# EAGLE design RatDBS-Plastic2032Battery (EAGLE 7.3.0)
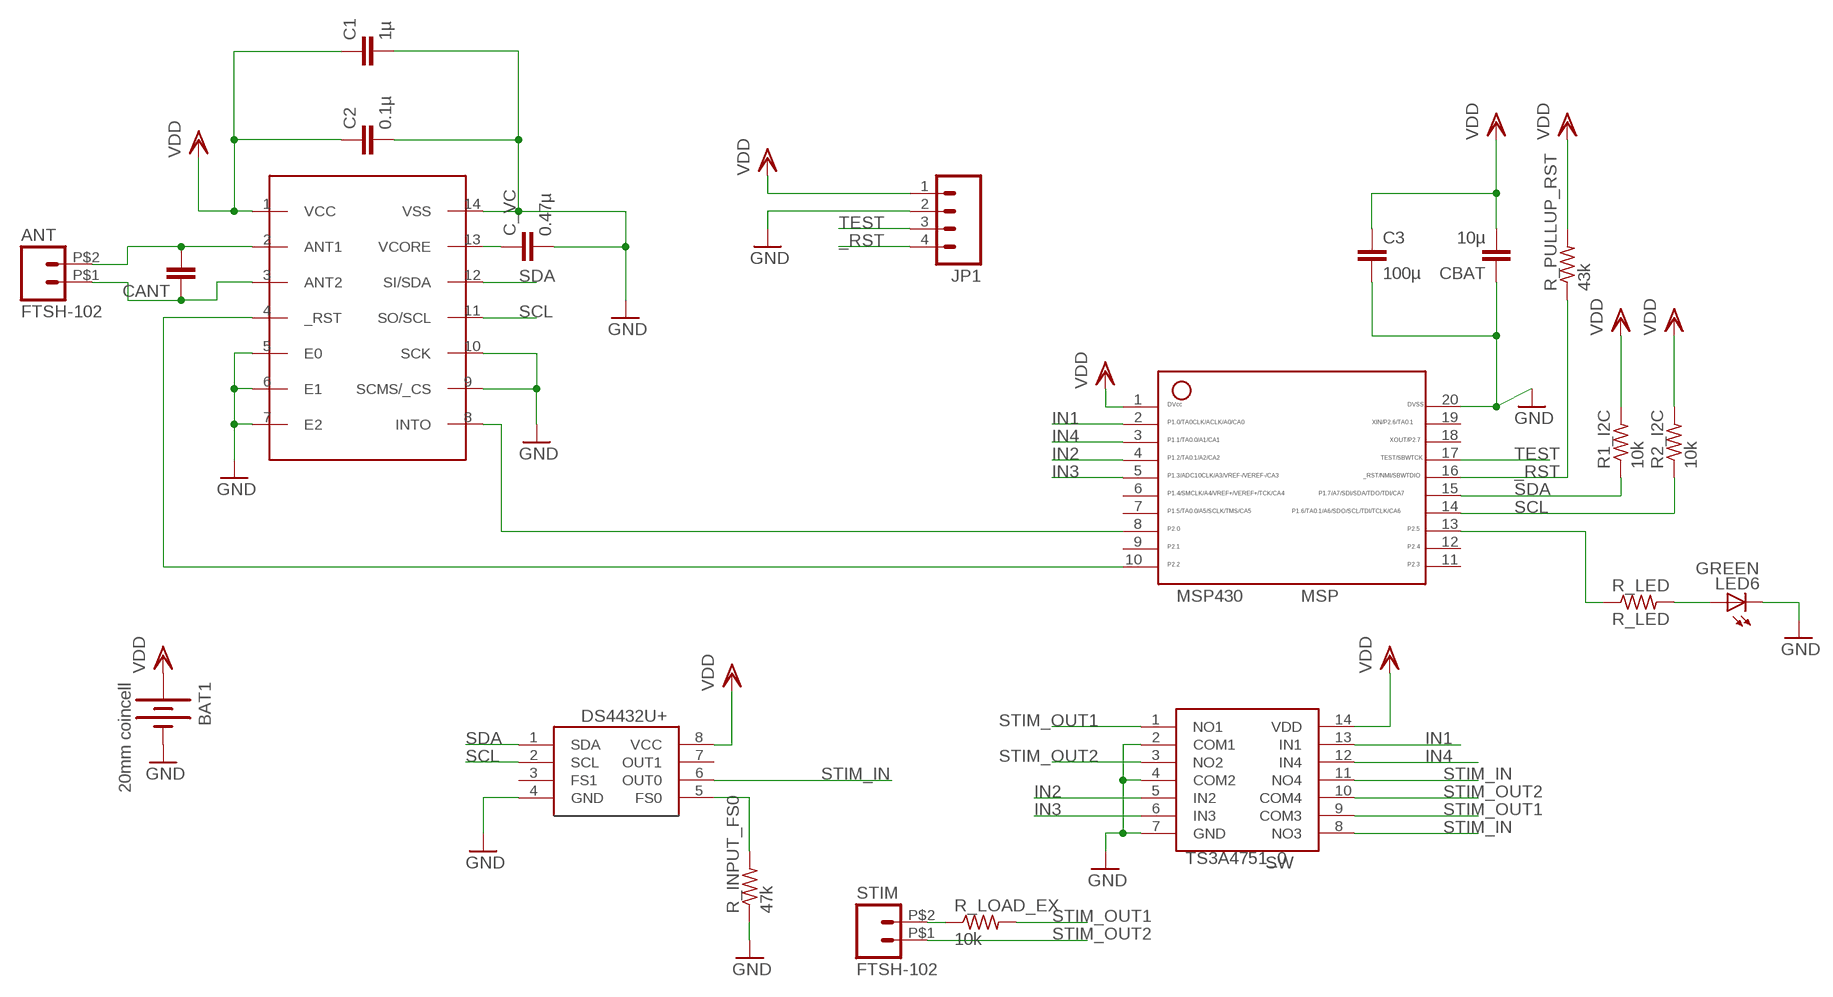
[diagram p0: schematic, sheet 1]

## Parts
ANT  FTSH-102  [FTSH-102-DH]
BAT1  20mm coincell  BATTERY  [BATTCOM_20MM_PLASTIC_STUDS]
C1  1µ  C-EUC0603  [C0603]
C2  0.1µ  C-EUC0603  [C0603]
C3  100µ  C-EUC1206  [C1206]
C_VC  0.47µ  C-EUC0603  [C0603]
CANT  C-EUC0603  [C0603]
CBAT  10µ  C-EUC0603  [C0603]
DS4432U+  DS4432U+  [8_PIN]
JP1  M041.27MM  [1X04-1.27MM]
LED6  GREEN  LED1206  [LED-1206]
MSP430  MSP  MSP430  [20_PIN]
R1_I2C  10k  R-US_R0603  [R0603]
R2_I2C  10k  R-US_R0603  [R0603]
R_INPUT_FS0  47k  R-US_R0603  [R0603]
R_LED  R_LED  R-US_R0603  [R0603]
R_LOAD_EX  10k  R-US_R0603  [R0603]
R_PULLUP_RST  43k  R-US_R0603  [R0603]
STIM  FTSH-102  [FTSH-102-DH]
TS3A4751_0  SW  TS3A4751  [14_PIN]
U$1  RF  RF430CL330H  [PW_R-PDSO-G14]

## Nets
_RST: JP1.4 MSP430.16 R_PULLUP_RST.1
GND: BAT1.2(-) C1.2 C2.2 C3.2 C_VC.2 CBAT.1 DS4432U+.4(GND) JP1.2 LED6.C MSP430.20 R_INPUT_FS0.1 TS3A4751_0.2(COM1) TS3A4751_0.4(COM2) TS3A4751_0.7(GND) U$1.5(E0) U$1.6(E1) U$1.7(E2) U$1.9(SCMS/_CS) U$1.10(SCK) U$1.14(VSS)
IN1: MSP430.2 TS3A4751_0.13(IN1)
IN2: MSP430.4 TS3A4751_0.5(IN2)
IN3: MSP430.5 TS3A4751_0.6(IN3)
IN4: MSP430.3 TS3A4751_0.12(IN4)
N$1: C_VC.1 U$1.13(VCORE)
N$2: ANT.P$2 CANT.2 U$1.2(ANT1)
N$3: MSP430.8 U$1.8(INTO)
N$4: R_LOAD_EX.1 STIM.P$2
N$5: MSP430.13 R_LED.1
N$6: MSP430.7
N$7: MSP430.10 U$1.4(_RST)
N$8: DS4432U+.5(FS0) R_INPUT_FS0.2
N$9: LED6.A R_LED.2
N$12: ANT.P$1 CANT.1 U$1.3(ANT2)
SCL: DS4432U+.2(SCL) MSP430.14 R2_I2C.1 U$1.11(SO/SCL)
SDA: DS4432U+.1(SDA) MSP430.15 R1_I2C.1 U$1.12(SI/SDA)
STIM_IN: DS4432U+.6(OUT0) TS3A4751_0.8(NO3) TS3A4751_0.11(NO4)
STIM_OUT1: R_LOAD_EX.2 TS3A4751_0.1(NO1) TS3A4751_0.9(COM3)
STIM_OUT2: STIM.P$1 TS3A4751_0.3(NO2) TS3A4751_0.10(COM4)
TEST: JP1.3 MSP430.17
VDD: BAT1.1(+) C1.1 C2.1 C3.1 CBAT.2 DS4432U+.8(VCC) JP1.1 MSP430.1 R1_I2C.2 R2_I2C.2 R_PULLUP_RST.2 TS3A4751_0.14(VDD) U$1.1(VCC)
Unconnected: DS4432U+.3(FS1) DS4432U+.7(OUT1) MSP430.6 MSP430.9 MSP430.11 MSP430.12 MSP430.18 MSP430.19

## Library data of the parts
ANT STIM = Samtec50Mil:FTSH-102
BAT1 = Battery:BATTERY: Compact CR2032 Battery Holder SMT ground pad 20MM_4LEGS, Digikey: BAT-HLD-001-THM-OTL
C1-C3 C_VC CANT CBAT = rcl:C-EU: CAPACITOR, European symbol
DS4432U+ = RatDBS:DS4432U+: DS4432U+ current DAC
JP1 = SparkFun:M04: Header 4 Standard 4-pin 0.1" header. Use with straight break away headers (SKU : PRT-00116), right angle break away headers (PRT-00553), swiss pins (PRT-00743), machine pins (PRT-00117), and female headers (PRT-00115). Molex polarized connector foot print use with SKU : PRT-08231 with associated crimp pins and housings.
LED6 = SparkFun-LED:LED: LEDs Standard schematic elements and footprints for 5mm, 3mm, 1206, and 0603 sized LEDs. 5mm - Spark Fun Electronics SKU : COM-00529 (and others)
MSP430 = RatDBS:MSP430: MSP430 20 pins
R1_I2C R2_I2C R_INPUT_FS0 R_LED R_LOAD_EX R_PULLUP_RST = BiphasicBoard:R-US_: RESISTOR, American symbol
TS3A4751_0 = BiphasicBoard:TS3A4751: TS3A4751 Quad Switch
U$1 = RF430CL330H:RF430CL330H

## Board
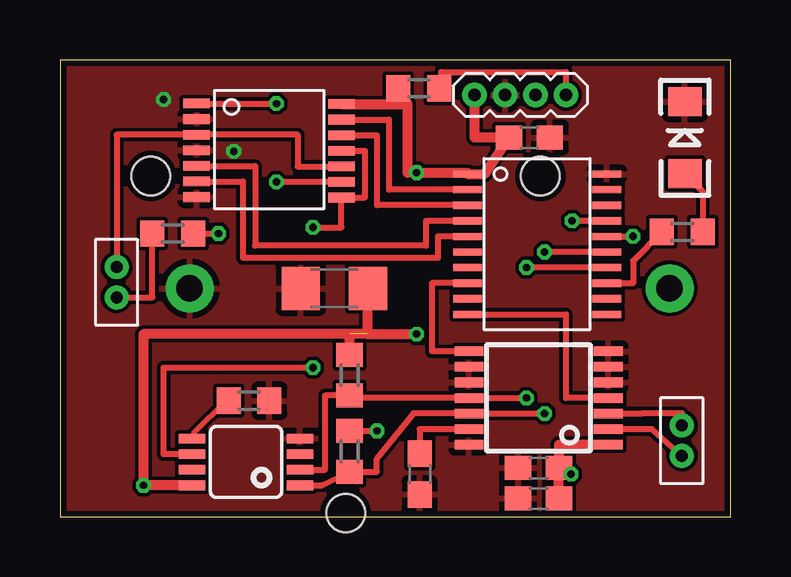
[diagram p1: board, top side]
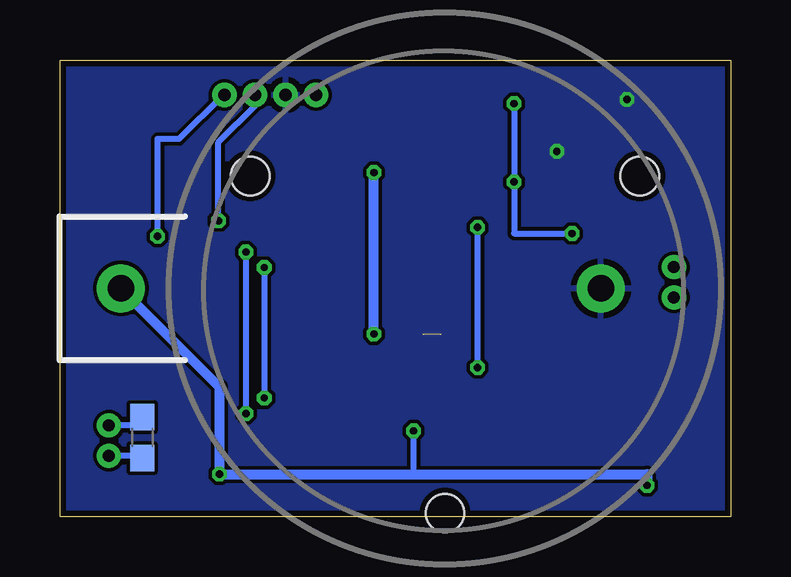
[diagram p2: board, bottom side, seen from below]

Size 27.94 x 19.05 mm. Coordinates in mm from the lower left corner, seen from the top.
Outline: 0,19.05 0,0 27.94,0 27.94,19.05 0,19.05
Copper layers (1*16): Top 0.035mm / dielectric 1.5mm / Bottom 0.035mm
Design rules "Seeed_DRU": minimum track width 6mil, minimum drill 12mil, track to track 6mil, track to pad 6mil, pad to pad 6mil, via to via 6mil, smd to smd 0mil, copper to edge 10mil, drill to drill 10mil, minimum pad ring 10mil, minimum via ring 6mil, stop-mask expansion 2mil, vias tented up to drill 100mil, thermal gap 10mil

### Footprints (pad centres in the part's own frame; a part is rotated, then mirrored left to right if it is on the bottom)
FTSH-102-DH = drill 0.5 pad 1: P$1 -0.635,0; P$2 0.635,0
BATTCOM_20MM_PLASTIC_STUDS = drill 1.1 pad 2: 1 13.5,0; 2 -6.5,0 | hole 1.6: 0,9.37; -8.115,-4.685; 8.115,-4.685
C0603 = smd 1.1 x 1: 1 -0.85,0; 2 0.85,0
C1206 = smd 1.6 x 1.8: 1 -1.4,0; 2 1.4,0
8_PIN = smd 1.1 x 0.4: 1 -2.25,0.975; 2 -2.25,0.325; 3 -2.25,-0.325; 4 -2.25,-0.975; 5 2.25,-0.975; 6 2.25,-0.325; 7 2.25,0.325; 8 2.25,0.975
1X04-1.27MM = drill 0.508 pad 1: 1 0,0; 2 1.27,0; 3 2.54,0; 4 3.81,0
LED-1206 = smd 1.2 x 1.4: A -1.5,0; C 1.5,0
20_PIN = smd 0.3 x 1.2: 1 -2.925,-2.9; 2 -2.275,-2.9; 3 -1.625,-2.9; 4 -0.975,-2.9; 5 -0.325,-2.9; 6 0.325,-2.9; 7 0.975,-2.9; 8 1.625,-2.9; 9 2.275,-2.9; 10 2.925,-2.9; 11 2.925,2.9; 12 2.275,2.9; 13 1.625,2.9; 14 0.975,2.9; 15 0.325,2.9; 16 -0.325,2.9; 17 -0.975,2.9; 18 -1.625,2.9; 19 -2.275,2.9; 20 -2.925,2.9
R0603 = smd 1 x 1.1: 1 -0.85,0; 2 0.85,0
14_PIN = smd 1.1 x 0.4: 1 -3.26,1.165; 2 -3.26,0.515; 3 -3.26,-0.135; 4 -3.26,-0.785; 5 -3.26,-1.435; 6 -3.26,-2.085; 7 -3.26,-2.735; 8 2.77,-2.755; 9 2.77,-2.105; 10 2.77,-1.455; 11 2.77,-0.805; 12 2.77,-0.155; 13 2.77,0.495; 14 2.77,1.145
PW_R-PDSO-G14 = smd 0.4 x 1.2: 1 -1.95,-2.9; 2 -1.3,-2.9; 3 -0.65,-2.9; 4 0,-2.9; 5 0.65,-2.9; 6 1.3,-2.9; 7 1.95,-2.9; 8 1.95,2.9; 9 1.3,2.9; 10 0.65,2.9; 11 0,2.9; 12 -0.65,2.9; 13 -1.3,2.9; 14 -1.95,2.9

### Placement (x,y rotation side)
ANT  25.91,3.17 270 top
BAT1  11.9,9.53 180 bottom
C1  19.94,2.03 180 top
C2  19.94,0.76 180 top
C3  11.43,9.53 180 top
C_VC  14.99,1.78 270 top
CANT  24.51,3.3 270 bottom
CBAT  19.56,15.81 180 top
DS4432U+  7.75,2.29 180 top
JP1  17.27,17.59 0 top
LED6  26.04,15.81 90 top
MSP430  19.88,11.37 270 top
R1_I2C  12.06,2.73 90 top
R2_I2C  12.06,5.91 90 top
R_INPUT_FS0  7.87,4.84 180 top
R_LED  25.93,11.88 0 top
R_LOAD_EX  4.7,11.81 0 top
R_PULLUP_RST  14.95,17.87 180 top
STIM  2.36,9.78 270 top
TS3A4751_0  8.95,16.07 0 top
U$1  19.94,4.95 90 top

### Tracks (layer width: path | path; a pad name or v marks a point on that pad's centre or on a via)
_RST  (via drill 0.3)
  Top 0.254: R_PULLUP_RST.1 15.88,17.87 15.88,18.54 21.08,18.54 JP1.4 | MSP430.16 v23.88,11.69
  Bottom 0.254: JP1.4 21.14,17.59 22.99,15.75 23.88,15.75 v23.88,11.69
GND  (via drill 0.3)
  other vias: 4.32,17.4 7.24,15.24
  pour Bottom: 0,19.05 27.94,19.05 27.94,0 0,0
  pour Top: 0,19.05 27.94,19.05 27.94,0 0,0
IN1
  Top 0.254: MSP430.2 13.72,13.64 13.72,16.56 TS3A4751_0.13
IN2
  Top 0.254: TS3A4751_0.5 8.13,14.63 8.13,11.3 15.24,11.3 15.24,12.34 MSP430.4
IN3
  Top 0.254: TS3A4751_0.6 7.62,13.98 7.62,10.79 15.75,10.79 15.75,11.69 MSP430.5
IN4
  Top 0.254: TS3A4751_0.12 13.21,15.91 13.21,12.99 MSP430.3
N$1
  Top 0.254: U$1.13 14.99,3.65 C_VC.1
N$2
  Top 0.254: ANT.P$2 24.67,3.65 U$1.2
  Bottom 0.254: CANT.2 24.6,2.54 ANT.P$2
N$3
  Top 0.254: MSP430.8 15.49,9.74 15.49,6.9 U$1.8
N$4
  Top 0.254: STIM.P$2 3.85,9.14 R_LOAD_EX.1
N$5
  Top 0.254: MSP430.13 23.88,9.74 23.88,10.67 R_LED.1
N$7
  Top 0.254: MSP430.10 21.08,8.44 21.08,4.95 U$1.4
N$8
  Top 0.203: DS4432U+.5 5.54,3.45 6.96,4.88 R_INPUT_FS0.2
N$9
  Top 0.254: LED6.A 26.78,13.56 R_LED.2
N$12
  Top 0.254: U$1.3 24.26,4.3 25.91,4.32 ANT.P$1
  Bottom 0.254: CANT.1 24.85,3.81 ANT.P$1
SCL  (via drill 0.3)
  Top 0.254: DS4432U+.2 11.05,1.96 11.05,5.06 R2_I2C.1 12.06,4.95 U$1.11 v19.43,4.95 | MSP430.14 v19.43,10.39
  Bottom 0.254: v19.43,10.39 v19.43,4.95
SDA  (via drill 0.3)
  Top 0.254: MSP430.15 v20.19,11.04 | DS4432U+.1 10.92,1.31 R1_I2C.1 13.21,1.88 13.21,2.41 14.73,4.32 U$1.12 v20.19,4.3
  Bottom 0.254: v20.19,11.04 v20.19,4.3
STIM_IN  (via drill 0.3)
  Top 0.254: DS4432U+.6 4.32,2.61 4.32,6.22 v10.54,6.22 | v10.54,12.06 11.72,12.06 TS3A4751_0.8 12.7,13.31 12.7,15.26 TS3A4751_0.11
  Bottom 0.254: v10.54,6.22 v10.54,12.06
STIM_OUT1  (via drill 0.3)
  Top 0.254: TS3A4751_0.9 v9.02,13.96 | TS3A4751_0.1 v9.02,17.23 | R_LOAD_EX.2 v6.6,11.81
  Bottom 0.254: v9.02,17.23 v9.02,13.96 9.02,11.81 v6.6,11.81
STIM_OUT2
  Top 0.254: TS3A4751_0.10 9.91,14.61 9.91,15.93 TS3A4751_0.3 2.36,15.93 STIM.P$1
TEST  (via drill 0.3)
  Top 0.254: MSP430.17 v21.34,12.34
  Bottom 0.254: v21.34,12.34 21.34,15.62 19.81,17.14 JP1.3
VDD  (via drill 0.3)  (1 unrouted)
  Top 0.254: R_PULLUP_RST.2 14.22,17.87 14.22,17.21 | R1_I2C.2 v13.21,3.58
  Top 0.406: R2_I2C.2 12.06,7.62 | 12.83,7.62 3.48,7.62 v3.48,1.31 DS4432U+.8 | TS3A4751_0.14 14.22,17.21 14.48,17.21 14.48,14.35 v14.86,14.35 16.98,14.35 MSP430.1 17.7,14.29 CBAT.2 17.27,15.81 JP1.1 | 12.83,7.62 v14.86,7.62 | C2.1 C1.1 | U$1.1 20.79,3 C1.1 | v21.3,1.78 20.79,1.78 C1.1 | 12.83,7.62 C3.1
  Bottom 0.254: 13.21,1.78 v13.21,3.58
  Bottom 0.406: v3.48,1.31 3.48,1.78 13.21,1.78 v21.3,1.78 21.3,5.42 BAT1.1 | v14.86,7.62 v14.86,14.35

### Text on the board
tDocu: STIM
bDocu: NFC-RDBS v1.2 / Kemere Lab / (C)2015